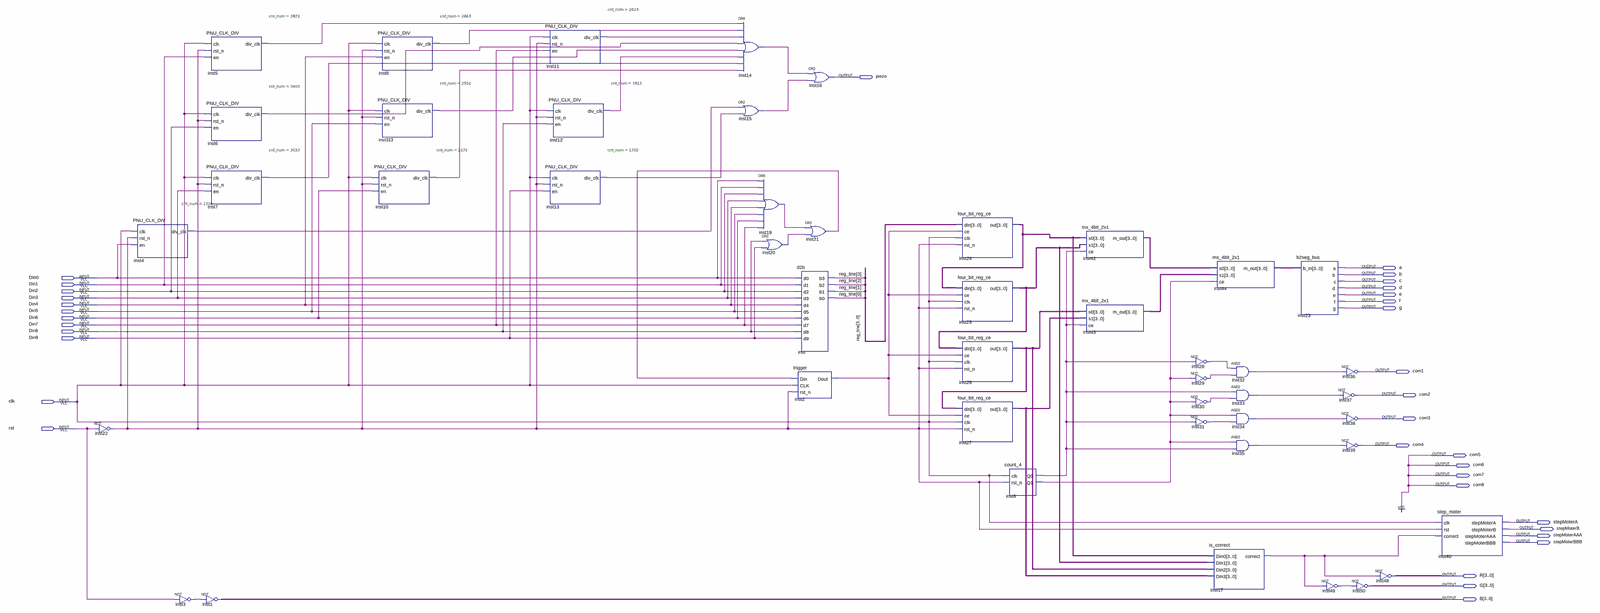
[diagram p0: schematic sheet, whole]
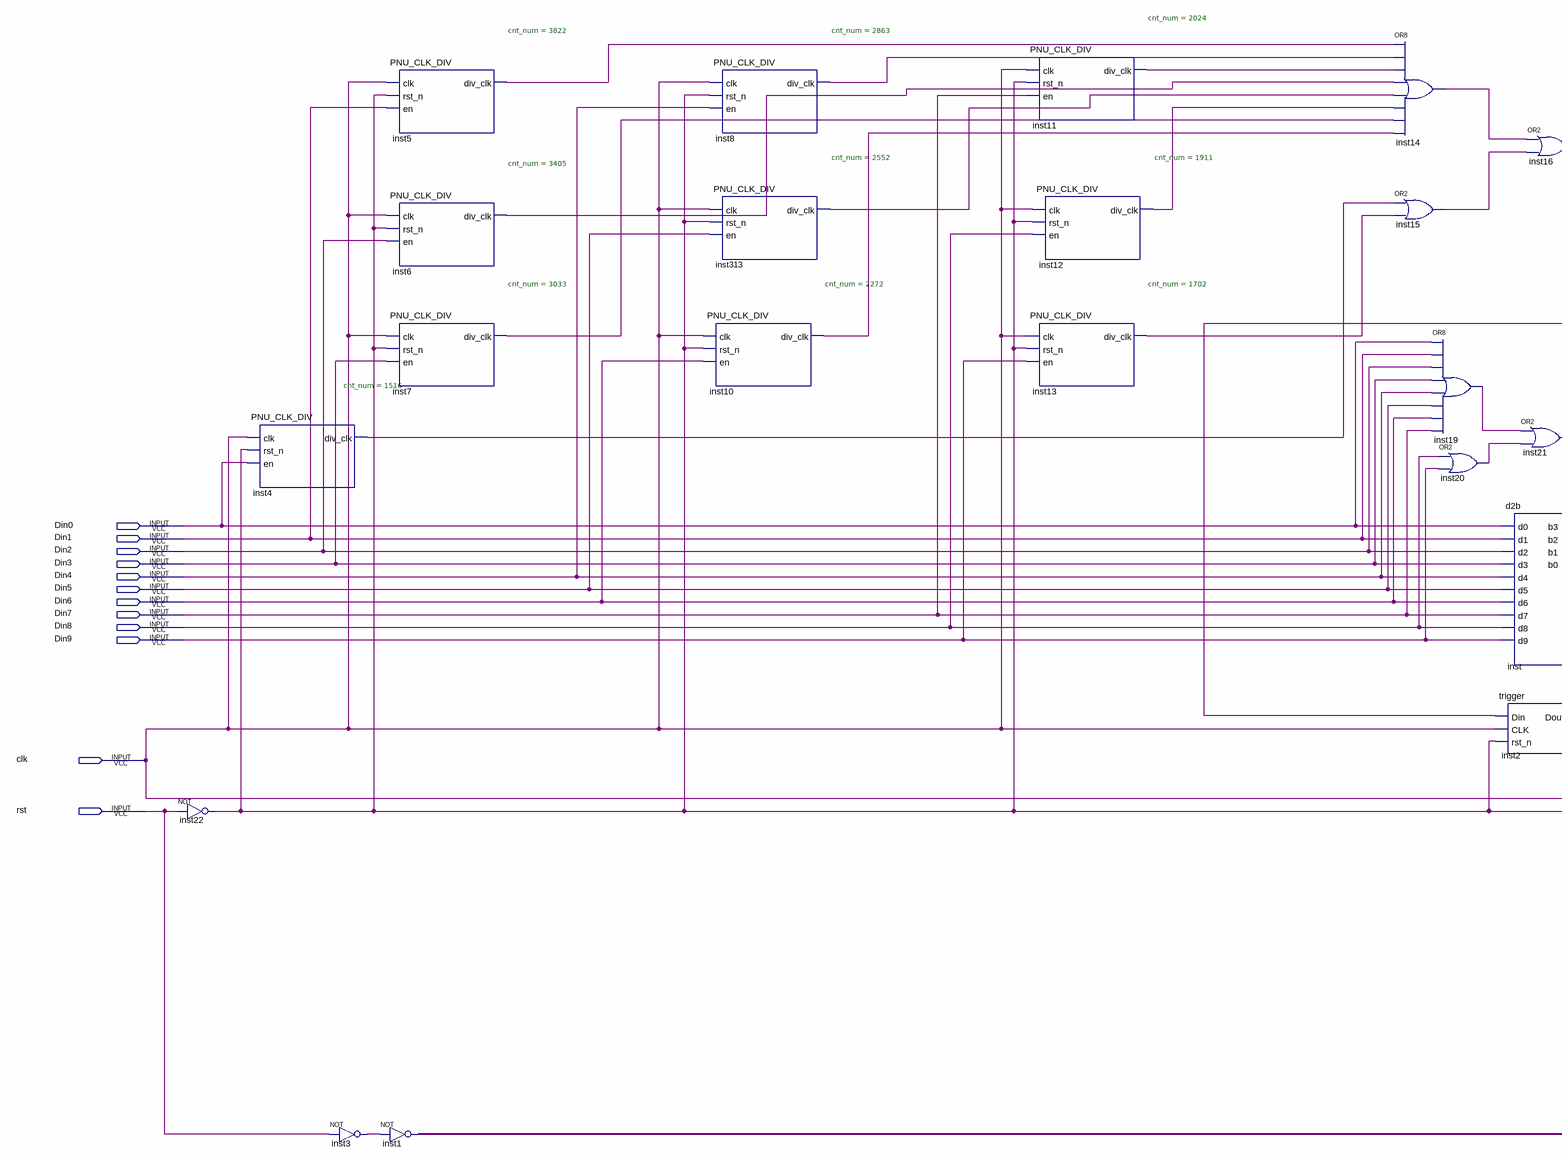
[diagram p1: schematic sheet, left part]
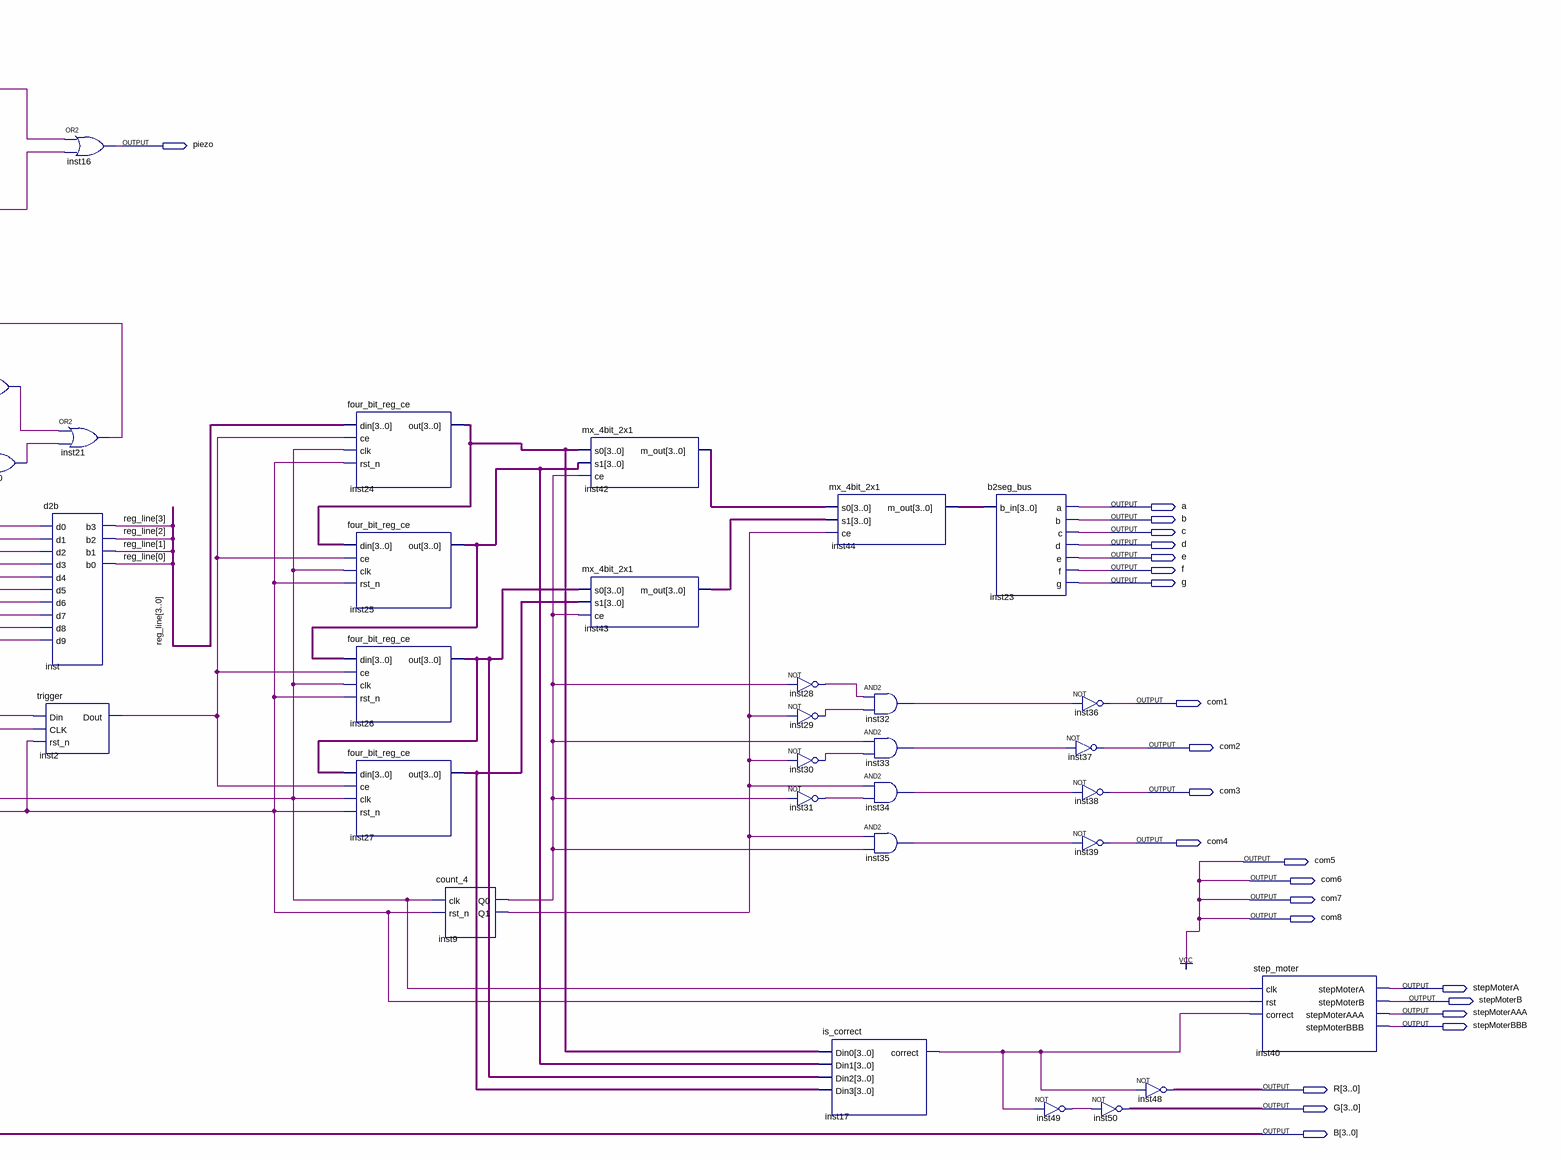
[diagram p2: schematic sheet, right part]
// Quartus schematic ten_week_2.bdf as structural Verilog: 47 symbols, 35 pins
module ten_week_2 (
  input  Din0,
  input  Din1,
  input  Din2,
  input  Din3,
  input  Din4,
  input  Din5,
  input  Din6,
  input  Din7,
  input  Din8,
  input  Din9,
  input  clk,
  input  rst,
  output piezo,
  output a,
  output b_1bit,
  output c,
  output d,
  output e,
  output f,
  output g_1bit,
  output com1,
  output com2,
  output com3,
  output com4,
  output com5,
  output com6,
  output com7,
  output com8,
  output stepMoterA,
  output stepMoterB,
  output stepMoterAAA,
  output stepMoterBBB,
  output [3:0] R,
  output [3:0] g,
  output [3:0] b
);

  wire inst2_dout, inst3_out, inst4_div_clk, inst5_div_clk, inst6_div_clk, inst7_div_clk, inst8_div_clk,
       inst9_q0, inst9_q1, inst10_div_clk, inst11_div_clk, inst12_div_clk, inst13_div_clk, inst14_out,
       inst15_out, inst17_correct, inst19_out, inst20_out, inst21_out, inst22_out, inst28_out, inst29_out,
       inst30_out, inst31_out, inst32_out, inst33_out, inst34_out, inst35_out, inst49_out, inst313_div_clk;
  wire [3:0] inst24_out, inst25_out, inst26_out, inst27_out, inst42_m_out, inst43_m_out, inst44_m_out,
       reg_line;

  not inst22 (inst22_out, rst);
  PNU_CLK_DIV #(.cnt_num(1516)) inst4 (.clk(clk), .rst_n(inst22_out), .en(Din0), .div_clk(inst4_div_clk));
  not inst3 (inst3_out, rst);
  PNU_CLK_DIV #(.cnt_num(3822)) inst5 (.clk(clk), .rst_n(inst22_out), .en(Din1), .div_clk(inst5_div_clk));
  PNU_CLK_DIV #(.cnt_num(3405)) inst6 (.clk(clk), .rst_n(inst22_out), .en(Din2), .div_clk(inst6_div_clk));
  PNU_CLK_DIV #(.cnt_num(3033)) inst7 (.clk(clk), .rst_n(inst22_out), .en(Din3), .div_clk(inst7_div_clk));
  assign b = ~{4{inst3_out}};  // NOT inst1, 4 bits wide
  PNU_CLK_DIV #(.cnt_num(2863)) inst8 (.clk(clk), .rst_n(inst22_out), .en(Din4), .div_clk(inst8_div_clk));
  PNU_CLK_DIV #(.cnt_num(2552)) inst313 (.clk(clk), .rst_n(inst22_out), .en(Din5), .div_clk(inst313_div_clk));
  PNU_CLK_DIV #(.cnt_num(2272)) inst10 (.clk(clk), .rst_n(inst22_out), .en(Din6), .div_clk(inst10_div_clk));
  PNU_CLK_DIV #(.cnt_num(2024)) inst11 (.clk(clk), .rst_n(inst22_out), .en(Din7), .div_clk(inst11_div_clk));
  PNU_CLK_DIV #(.cnt_num(1911)) inst12 (.clk(clk), .rst_n(inst22_out), .en(Din8), .div_clk(inst12_div_clk));
  PNU_CLK_DIV #(.cnt_num(1702)) inst13 (.clk(clk), .rst_n(inst22_out), .en(Din9), .div_clk(inst13_div_clk));
  or inst14 (inst14_out, inst5_div_clk, inst8_div_clk, inst11_div_clk, inst6_div_clk, inst313_div_clk, inst12_div_clk, inst7_div_clk, inst10_div_clk);
  or inst15 (inst15_out, inst4_div_clk, inst13_div_clk);
  or inst19 (inst19_out, Din0, Din1, Din2, Din3, Din4, Din5, Din6, Din7);
  or inst20 (inst20_out, Din8, Din9);
  d2b inst (
    .d0(Din0), .d1(Din1), .d2(Din2), .d3(Din3), .d4(Din4), .d5(Din5), .d6(Din6), .d7(Din7), .d8(Din8),
    .d9(Din9), .b3(reg_line[3]), .b2(reg_line[2]), .b1(reg_line[1]), .b0(reg_line[0]));
  trigger inst2 (.Din(inst21_out), .CLK(clk), .rst_n(inst22_out), .Dout(inst2_dout));
  or inst16 (piezo, inst14_out, inst15_out);
  or inst21 (inst21_out, inst19_out, inst20_out);
  four_bit_reg_ce inst24 (.din(reg_line), .ce(inst2_dout), .clk(clk), .rst_n(inst22_out), .out(inst24_out));
  four_bit_reg_ce inst25 (.din(inst24_out), .ce(inst2_dout), .clk(clk), .rst_n(inst22_out), .out(inst25_out));
  four_bit_reg_ce inst26 (.din(inst25_out), .ce(inst2_dout), .clk(clk), .rst_n(inst22_out), .out(inst26_out));
  four_bit_reg_ce inst27 (.din(inst26_out), .ce(inst2_dout), .clk(clk), .rst_n(inst22_out), .out(inst27_out));
  count_4 inst9 (.clk(clk), .rst_n(inst22_out), .Q0(inst9_q0), .Q1(inst9_q1));
  mx_4bit_2x1 inst42 (.s0(inst24_out), .s1(inst25_out), .ce(inst9_q0), .m_out(inst42_m_out));
  mx_4bit_2x1 inst43 (.s0(inst26_out), .s1(inst27_out), .ce(inst9_q0), .m_out(inst43_m_out));
  not inst28 (inst28_out, inst9_q0);
  not inst29 (inst29_out, inst9_q1);
  not inst30 (inst30_out, inst9_q1);
  not inst31 (inst31_out, inst9_q0);
  mx_4bit_2x1 inst44 (.s0(inst42_m_out), .s1(inst43_m_out), .ce(inst9_q1), .m_out(inst44_m_out));
  is_correct inst17 (
    .Din0(inst24_out), .Din1(inst25_out), .Din2(inst26_out), .Din3(inst27_out), .correct(inst17_correct));
  and inst32 (inst32_out, inst28_out, inst29_out);
  and inst33 (inst33_out, inst9_q0, inst30_out);
  and inst34 (inst34_out, inst9_q1, inst31_out);
  and inst35 (inst35_out, inst9_q1, inst9_q0);
  b2seg_bus inst23 (.b_in(inst44_m_out), .a(a), .b(b_1bit), .c(c), .d(d), .e(e), .f(f), .g(g_1bit));
  not inst49 (inst49_out, inst17_correct);
  not inst36 (com1, inst32_out);
  not inst37 (com2, inst33_out);
  not inst38 (com3, inst34_out);
  not inst39 (com4, inst35_out);
  assign g = ~{4{inst49_out}};  // NOT inst50, 4 bits wide
  assign R = ~{4{inst17_correct}};  // NOT inst48, 4 bits wide
  step_moter inst40 (
    .clk(clk), .rst(inst22_out), .correct(inst17_correct), .stepMoterA(stepMoterA), .stepMoterB(stepMoterB),
    .stepMoterAAA(stepMoterAAA), .stepMoterBBB(stepMoterBBB));

  assign com5 = 1'b1;
  assign com6 = 1'b1;
  assign com7 = 1'b1;
  assign com8 = 1'b1;
endmodule
